# EAGLE design ACESDS1307BoBV3 (EAGLE 9.4.2)
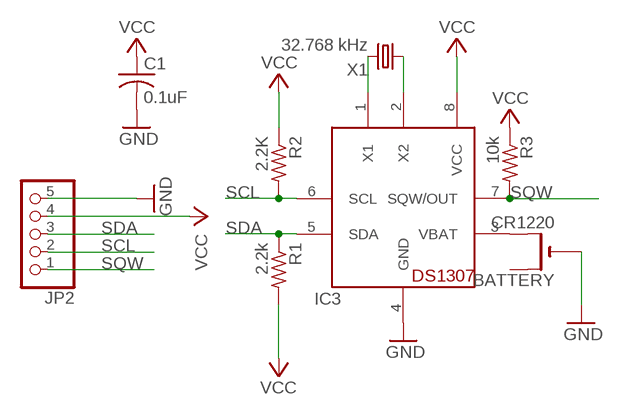
[diagram p0: schematic, sheet 1]

## Parts
BATTERY  CR1220  CR1220THM  [CR1220-THM]
C1  0.1uF  C-US025-025X050  [C025-025X050]
IC3  DS1307  [DIL08]
JP2  PINHD-1X5  [1X05]
R1  2.2k  R-US_0207/10  [0207/10]
R2  2.2K  R-US_0207/10  [0207/10]
R3  10k  R-US_0207/10  [0207/10]
X1  32.768 kHz  CRYTALTC38H  [TC38H]

## Nets
GND: BATTERY.- C1.2 IC3.4(GND) JP2.5
N$14: IC3.1(X1) X1.2
N$15: IC3.2(X2) X1.1
N$39: BATTERY.+2(+1) IC3.3(VBAT)
SCL: IC3.6(SCL) JP2.2 R2.2
SDA: IC3.5(SDA) JP2.3 R1.1
SQW: IC3.7(SQW/OUT) JP2.1 R3.2
VCC: C1.1 IC3.8(VCC) JP2.4 R1.2 R2.1 R3.1
Unconnected: BATTERY.+1(+)

## Library data of the parts
BATTERY = adafruit:CR1220: CR1216/CR1220/CR1225 12mm 3V lithium coin cell Great for battery packup. Both SMT and THM holders. Note the THM package has the ground pads on both sides of the PCB so that the masks are the same - this reduces the cost
C1 = adafruit:C-US: CAPACITOR, American symbol
IC3 = adafruit:DS1307: DS1307 Real time clock (RTC) with battery backup ability. Talk to it via i2c
JP2 = pinhead:PINHD-1X5: PIN HEADER
R1-R3 = adafruit:R-US_: RESISTOR, American symbol
X1 = crystal:CRYTAL: CRYSTAL

## Board
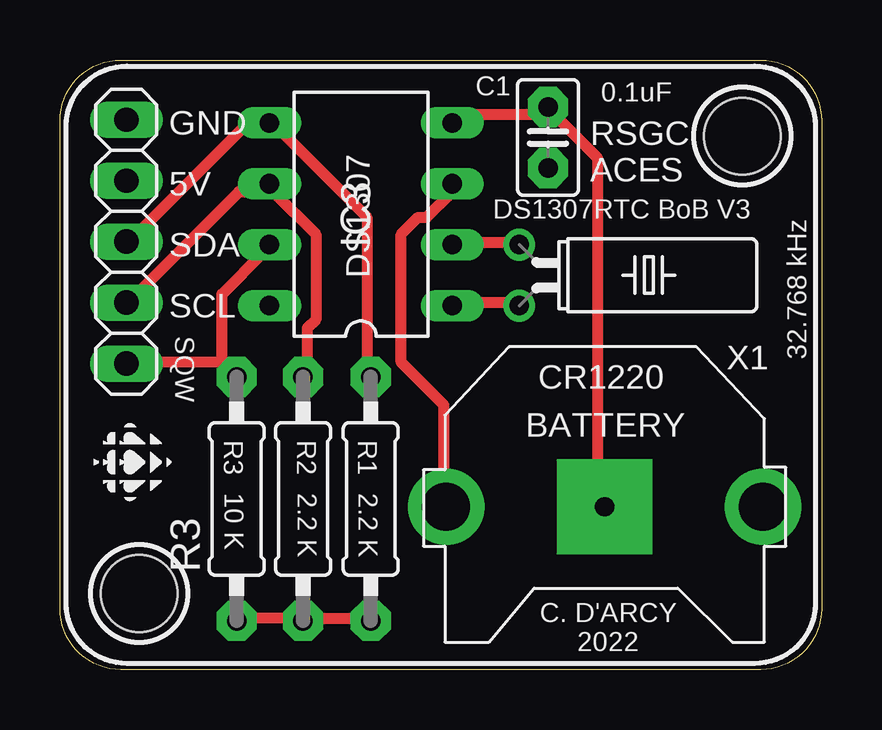
[diagram p1: board, top side]
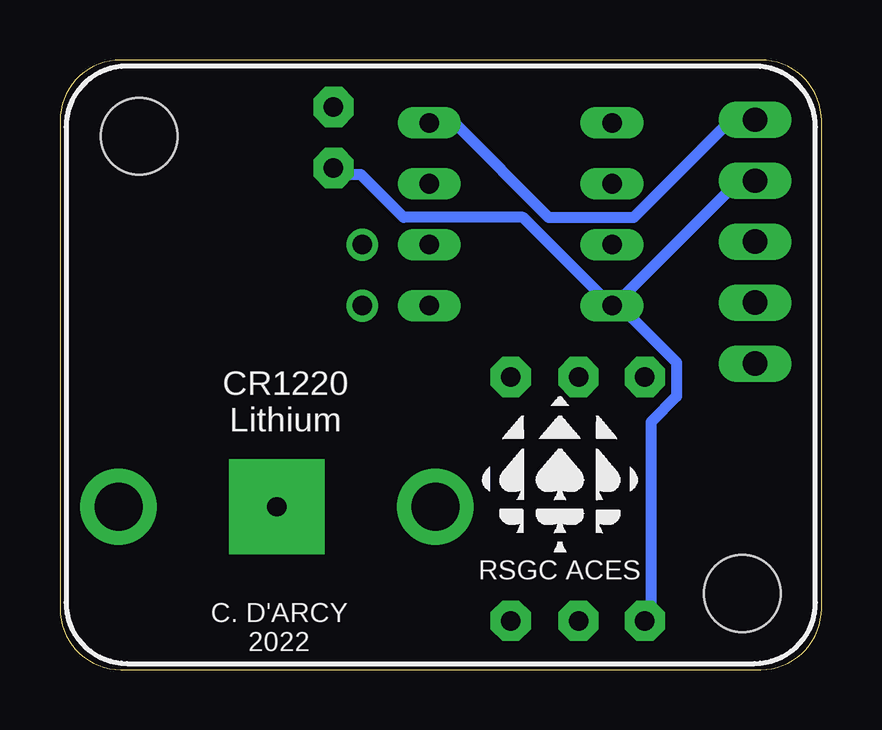
[diagram p2: board, bottom side, seen from below]

Size 31.75 x 25.4 mm. Coordinates in mm from the lower left corner, seen from the top.
Outline: 29.21,0 2.54,0 arc-90 0,2.54 0,22.86 arc-90 2.54,25.4 29.21,25.4 arc-90 31.75,22.86 31.75,2.54 arc-90 29.21,0
Copper layers (1*16): Top 0.035mm / dielectric 1.5mm / Bottom 0.035mm
Design rules "ACES_THT": minimum track width 18mil, minimum drill 0.35mm, track to track 10mil, track to pad 10mil, pad to pad 10mil, via to via 10mil, smd to smd 6mil, copper to edge 40mil, drill to drill 6mil, minimum pad ring 10mil, minimum via ring 8mil, stop-mask expansion 4mil, vias tented up to drill 0mil, thermal gap 10mil
Holes 3.2 mm at 28.45,22.23 3.3,3.17

### Footprints (pad centres in the part's own frame; a part is rotated, then mirrored left to right if it is on the bottom)
CR1220-THM = drill 2 pad 3.175: +1 -6.604,0; +2 6.604,0 | drill 0.8 pad 3.962 square: - 0,0
C025-025X050 = drill 0.813 pad 1.676 octagon: 1 -1.27,0; 2 1.27,0
DIL08 = drill 0.813 long: 1 -3.81,-3.81; 2 -1.27,-3.81; 3 1.27,-3.81; 4 3.81,-3.81; 5 3.81,3.81; 6 1.27,3.81; 7 -1.27,3.81; 8 -3.81,3.81
1X05 = drill 1.016 long: 1 -5.08,0; 2 -2.54,0; 3 0,0; 4 2.54,0; 5 5.08,0
0207/10 = drill 0.813 pad 1.676 octagon: 1 -5.08,0; 2 5.08,0
TC38H = drill 0.813: 1 -1.27,0; 2 1.27,0

### Placement (x,y rotation side)
BATTERY  22.71,6.78 180 top
C1  20.35,22.17 90 top
IC3  12.55,18.97 90 top
JP2  2.77,17.83 90 top
R1  12.95,7.11 270 top
R2  10.13,7.11 90 top
R3  7.37,7.11 90 top
U$1  [MEDIUM_BSILK_TEXT]  10.92,7.87 0 top
U$2  [SMALL_TSILK]  3.05,8.64 270 top
X1  19.15,16.43 270 top

### Tracks (layer width: path | path; a pad name or v marks a point on that pad's centre or on a via)
GND
  Top 0.457: IC3.4 16.36,23.11 20.27,23.11 C1.2 20.62,23.11 22.4,21.34 22.4,7.11 BATTERY.-
  Bottom 0.457: JP2.5 2.85,22.76 3.91,22.76 7.82,18.85 11.38,18.85 15.29,22.76 16.36,22.76 IC3.4
N$14
  Top 0.457: IC3.1 16.36,15.29 18.85,15.29 X1.2
N$15
  Top 0.457: IC3.2 16.36,17.78 18.85,17.78 X1.1
N$39
  Top 0.457: IC3.3 16.36,19.91 15.29,18.85 14.94,18.85 14.22,18.14 14.22,12.8 16,11.02 16,7.11 BATTERY.+2
SCL
  Top 0.457: JP2.2 2.85,15.29 7.47,19.91 8.53,19.91 IC3.6 8.89,19.91 10.67,18.14 10.67,14.58 10.31,14.22 10.31,12.45 R2.2
SDA
  Top 0.457: JP2.3 2.85,17.78 7.82,22.76 8.53,22.76 IC3.5 8.89,22.76 12.8,18.85 12.8,12.45 R1.1
SQW
  Top 0.457: 6.76,12.8 6.76,15.65 8.53,17.42 IC3.7 | R3.2 6.76,12.8 | 6.76,12.8 2.85,12.8 JP2.1
VCC
  Top 0.457: R3.1 7.47,2.13 9.96,2.13 R2.1 10.31,2.13 12.8,2.13 R1.2
  Bottom 0.457: 8.53,15.29 3.56,20.27 2.85,20.27 JP2.4 | C1.1 20.27,20.62 19.2,20.62 17.42,18.85 12.45,18.85 8.89,15.29 IC3.8 8.53,15.29 | 8.53,15.29 6.04,12.8 6.04,11.38 7.11,10.31 7.11,2.13 R3.1

### Text on the board
tSilk: GND | 5V | RSGC / ACES | DS1307RTC BoB V3 | SDA | SCL | SQW | R3 | R2 | R1 | 10 K | 2.2 K | 2.2 K
_tsilk: C. D'ARCY / 2022
_bsilk: CR1220 / Lithium | C. D'ARCY / 2022